# Altium schematic sheet Power.SchDoc
size Tabloid
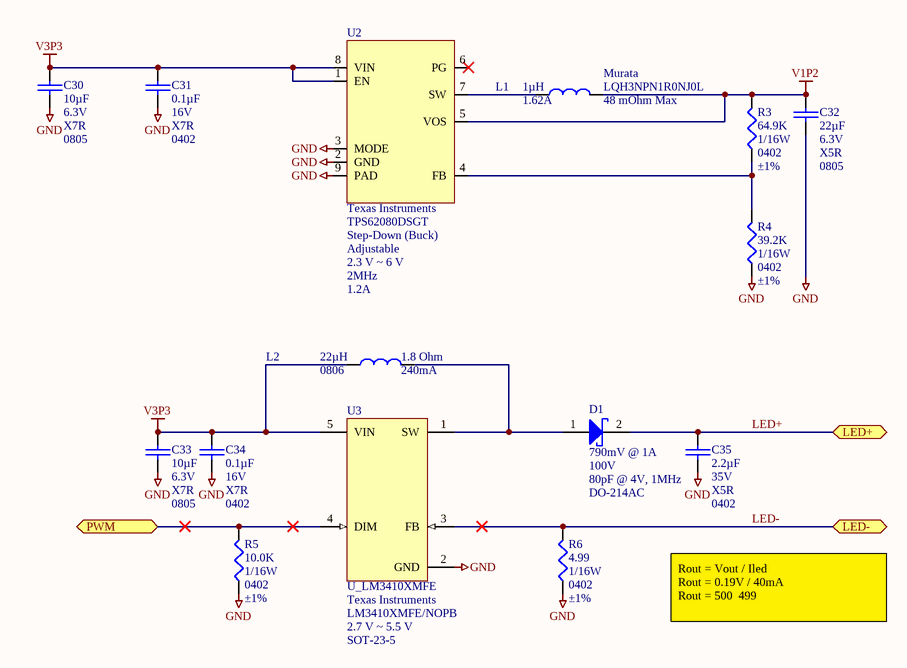
[diagram p0: Power.SchDoc]

## Parts
C30  Capacitance: 10µF  Voltage - Rated: 6.3V  Temperature Coefficient: X7R  Package / Case: 0805  [C_ERA-0805]  (hidden comment: 10uF)
C31  Capacitance: 0.1µF  Voltage - Rated: 16V  Temperature Coefficient: X7R  Package / Case: 0402  [C_ERA-0402]  (hidden comment: 0.1uF)
C32  Capacitance: 22µF  Voltage - Rated: 6.3V  Temperature Coefficient: X5R  Package / Case: 0805  [C_ERA-0805]  (hidden comment: 22uF)
C33  Capacitance: 10µF  Voltage - Rated: 6.3V  Temperature Coefficient: X7R  Package / Case: 0805  [C_ERA-0805]  (hidden comment: 10uF)
C34  Capacitance: 0.1µF  Voltage - Rated: 16V  Temperature Coefficient: X7R  Package / Case: 0402  [C_ERA-0402]  (hidden comment: 0.1uF)
C35  Capacitance: 2.2µF  Voltage - Rated: 35V  Temperature Coefficient: X5R  Package / Case: 0402  [C_ERA-0402]  (hidden comment: C_0402_2.2uF_35V)
D1  Voltage - Forward (Vf) (Max) @ If: 790mV @ 1A  Voltage - DC Reverse (Vr) (Max): 100V  Capacitance @ Vr, F: 80pF @ 4V, 1MHz  Package / Case: DO-214AC  [DIOM5226X23L]  (hidden comment: B1100-13-F)
L1  Manufacturer Part Number: LQH3NPN1R0NJ0L  Inductance: 1µH  Current: 1.62A  DC Resistance (DCR): 48 mOhm Max  Manufacturer: Murata  [INDNRH1212]  (hidden comment: 1.0uH)
L2  Current: 240mA  Package / Case: 0806  Inductance: 22µH  DC Resistance (DCR): 1.8 Ohm  [L_0806]  (hidden comment: CBC2016T220K)
R3  Resistance In Ohms: 64.9K  Power (Watts): 1/16W  Case: 0402  Tolerance: ±1%  [ERA-0402]  (hidden comment: R_0402_64.9K)
R4  Resistance In Ohms: 39.2K  Power (Watts): 1/16W  Case: 0402  Tolerance: ±1%  [ERA-0402]  (hidden comment: R_0402_39.2K)
R5  Resistance In Ohms: 10.0K  Power (Watts): 1/16W  Case: 0402  Tolerance: ±1%  [R_0402]  (hidden comment: R_0402_10.0K)
R6  Resistance In Ohms: 4.99  Power (Watts): 1/16W  Case: 0402  Tolerance: ±1%  [R_0402]  (hidden comment: R_0402_4.99)
U2  Manufacturer: Texas Instruments  Manufacturer Part Number: TPS62080DSGT  Type: Step-Down (Buck)  Output Type: Adjustable  Voltage - Input: 2.3 V ~ 6 V  Frequency - Switching: 2MHz  Current - Output: 1.2A  [QFN50P200X200X80-8L]  (hidden comment: TPS62080)
U3  U_LM3410XMFE  Manufacturer: Texas Instruments  Manufacturer Part Number: LM3410XMFE/NOPB  Voltage - Supply: 2.7 V ~ 5.5 V  Supplier Device Package: SOT-23-5  [MF05A_N]

## Ports
LED+, LED-, PWM

## Nets
GND: C30.1 C31.1 C32.1 C33.1 C34.1 C35.1 R4.2 R5.2 R6.2 U2.2(GND) U2.3(MODE) U2.9(PAD) U3.2(GND)
V1P2: C32.2 L1.2 R3.1 U2.5(VOS)
V3P3: C30.2 C31.2 C33.2 C34.2 L2.1 U2.1(EN) U2.8(VIN) U3.5(VIN)
LED+: C35.2 D1.2(K) ; port LED+
LED-: R6.1 U3.3(FB) ; port LED-
PWM: R5.1 U3.4(DIM) ; port PWM
NetD1_1: D1.1(A) L2.2 U3.1(SW)
NetL1_1: L1.1 U2.7(SW)
NetR3_2: R3.2 R4.1 U2.4(FB)

Not connected (* = marked no-connect by the designer): U2 6(PG)*

## Notes on the sheet
- Rout = Vout / Iled
  Rout = 0.19V / 40mA
  Rout = 500  499
- Title:
- http://www.cospandesign.com
- Cospan Design
- Project:
- Document:
- Engineer:
- Drawn By:
- Approved By:
- Revision:
- Date:
- Number:
- of

## Library data of the parts
C30 C33 = C_0805_10UF_6.3V: CAP CER 10UF 6.3V X7R 10% 0805; Manufacturer: Taiyo Yuden; Manufacturer Part Number: JMK212BJ106KD-T; Supplier 1: Digi-Key; Supplier Part Number 1: 587-1304-1-ND; RoHS: RoHS Compliant; Category: Capacitors; Stock 1: 94004; Tolerance: ±10%; Mounting Type: Surface Mount, MLCC; Operating Temperature: -55°C ~ 85°C; Applications: General Purpose; Ratings: -; Size / Dimension: 0.079" L x 0.049" W (2.00mm x 1.25mm); Lead Spacing: -; Features: -; Packaging: Cut Tape (CT); Lead Style: -; ComponentLink1URL: http://www.yuden.co.jp/productdata/catalog/en/mlcc01_e.pdf; ComponentLink1Description: http://www.yuden.co.jp/productdata/catalog/en/mlcc01_e.pdf; Pricing 1: 1=0.19, 10=0.132, 50=0.08, 100=0.0672, 250=0.0544, 500=0.048, 1000=0.0408 (USD); Height - Seated (Max): -; Thickness (Max): 0.037" (0.95mm)
C31 C34 = C_0402_0.1UF_16V: CAP CER .10UF 16V X7R 0402; Manufacturer: TDK Corporation; Manufacturer Part Number: C1005X7R1C104K; Tolerance: ±10%; Supplier 1: Digi-Key; Supplier Part Number 1: 445-4952-1-ND; RoHS: RoHS Compliant; Category: Capacitors; Stock 1: 230800; Pricing: 10=0.024, 100=0.0143, 500=0.00826, 1000=0.00572 (USD); Mounting Type: Surface Mount, MLCC; Features: General Purpose; Lead Spacing: -; Thickness: 0.50mm; Packaging: Cut Tape (CT); ComponentLink1URL: http://www.tdk.co.jp/tefe02/e412_c.pdf; ComponentLink1Description: http://www.tdk.co.jp/tefe02/e412_c.pdf; Operating Temperature: -55°C ~ 125°C
C32 = C_0805_22UF_6.3V: CAP CER 22UF 6.3V X7R 10% 0805; Manufacturer: AVX Corporation; Manufacturer Part Number: 08056D226MAT2A; Tolerance: ±20%; Supplier 1: Digi-Key; Supplier Part Number 1: 478-3647-1-ND; RoHS: RoHS Compliant; Category: Capacitors; Stock 1: 183735; Pricing: 10=0.66, 100=0.39, 500=0.225, 1000=0.156 (USD); Mounting Type: Surface Mount, MLCC; Operating Temperature: -55°C ~ 85°C; Applications: General Purpose; Ratings: -; Size / Dimension: 0.079" L x 0.049" W (2.01mm x 1.25mm); Height: -; Thickness: 0.055" (1.40mm); Lead Spacing: -; Features: -; Packaging: Cut Tape (CT); Lead Style: -; ComponentLink1URL: http://www.avx.com/docs/Catalogs/cx5r.pdf; ComponentLink1Description: http://www.avx.com/docs/Catalogs/cx5r.pdf; Supplier 2: Digi-Key; Supplier Part Number 2: 587-1305-1-ND; Stock 2: 167108; Height - Seated (Max): -; Thickness (Max): 0.053" (1.35mm); ComponentLink2URL: http://www.yuden.co.jp/productdata/catalog/en/mlcc01_e.pdf; ComponentLink2Description: http://www.yuden.co.jp/productdata/catalog/en/mlcc01_e.pdf
C35 = C_0402_2.2uF_35V: CAP CER 2.2UF 35V 20% X5R 0402; Manufacturer: TDK Corporation; Manufacturer Part Number: C1005X5R1V225M050BC; Supplier 1: Digi-Key; Supplier Part Number 1: 445-9056-1-ND; RoHS: RoHS Compliant; Category: Capacitors; Stock 1: 23001; Pricing: 1=0.37, 10=0.308, 100=0.154, 250=0.11552, 500=0.10202, 1000=0.09048, 5000=0.07508 (USD); Packaging: Cut Tape (CT); Tolerance: ±20%; Mounting Type: Surface Mount, MLCC; Operating Temperature: -55°C ~ 85°C; Applications: General Purpose; Ratings: -; Size / Dimension: 0.039" L x 0.020" W (1.00mm x 0.50mm); Height - Seated (Max): -; Thickness (Max): 0.022" (0.55mm); Lead Spacing: -; Features: -; Lead Style: -; ComponentLink1URL: http://product.tdk.com/en/catalog/datasheets/mlcc_commercial_general_en.pdf; ComponentLink1Description: http://product.tdk.com/en/catalog/datasheets/mlcc_commercial_general_en.pdf
D1 = D_SCHOTT_B1100-13-F: DIODE SCHOTTKY 100V 1A SMA; Manufacturer: Diodes Inc; Speed: Fast Recovery =< 500ns, > 200mA (Io); Current - Reverse Leakage @ Vr: 500µA @ 100V; Supplier 1: Digi-Key; Supplier Part Number 1: B1100-FDICT-ND; Manufacturer Part Number: B1100-13-F; RoHS: RoHS Compliant; Category: Discrete Semiconductor Products; Stock 1: 109264; Pricing: 1=0.57, 10=0.4, 25=0.3288, 100=0.2627, 250=0.1914, 500=0.15544, 1000=0.11948, 2500=0.1073 (USD); Diode Type: Schottky; Current - Average Rectified (Io): 1A; Reverse Recovery Time (trr): -; Mounting Type: Surface Mount; Supplier Device Package: SMA; Packaging: Cut Tape (CT); ComponentLink1URL: http://www.diodes.com/datasheets/ds30018.pdf; ComponentLink1Description: http://www.diodes.com/datasheets/ds30018.pdf; COST_1: *; COST_100: *; COST_1000: *; MANF1: *; MANF1_PN: *; MANF2: *; MANF2_PN: *; MANF3: *; MANF3_PN: *; VENDOR1: *; VENDOR1_PN: *
L1 = L_1.0UH_1.62A: INDUCTOR POWER 1.0UH 1620MA 1212; Current - Saturation: 1.65A; Type: Ferrite Core; Tolerance: ±30%; Shielding: Shielded; Frequency - Self Resonant: 140MHz; Material - Core: Ferrite; Frequency - Test: 1MHz; Supplier 1: Digi-Key; Supplier Part Number 1: 490-5342-1-ND; RoHS: RoHS Compliant; Category: Inductors, Coils, Chokes; Stock 1: 2940; Pricing: 1=0.43, 10=0.387, 25=0.3436, 50=0.3006, 100=0.2792, 250=0.25772, 500=0.24482 (USD); Current - Temperature Rise: 1.62A; Q @ Freq: -; Applications: Power Supplies; Package / Case: 1212 (3030 Metric); Mounting Type: Surface Mount; Packaging: Cut Tape (CT); Operating Temperature: -40°C ~ 85°C; ComponentLink1URL: http://search.murata.co.jp/Ceramy/image/img/PDF/ENG/L0075S0103LQH3NP_J0.pdf; ComponentLink1Description: http://search.murata.co.jp/Ceramy/image/img/PDF/ENG/L0075S0103LQH3NP_J0.pdf
L2 = L_0806_22uH: INDUCTOR 22UH 10% 0806 SMD; Manufacturer: Taiyo Yuden; Type: Wirewound; Current - Saturation: 250mA; Shielding: Unshielded; Frequency - Self Resonant: 16MHz; Frequency - Test: 2.52MHz; Supplier 1: Digi-Key; Supplier Part Number 1: 587-3048-1-ND; Manufacturer Part Number: CBC2016T220K; RoHS: RoHS Compliant; Category: Inductors, Coils, Chokes; Stock 1: 3275; Pricing: 1=0.2, 10=0.192, 50=0.18, 100=0.168, 500=0.132, 1000=0.108 (USD); Packaging: Cut Tape (CT); Material - Core: -; Tolerance: ±10%; Current Rating: 240mA; Q @ Freq: -; Operating Temperature: -40°C ~ 105°C; Mounting Type: Surface Mount; Size / Dimension: 0.079" L x 0.063"W (2.00mm x 1.60mm); Height - Seated (Max): 0.071" (1.80mm); Supplier Device Package: 0806 (2016 Metric); ComponentLink1URL: http://www.yuden.co.jp/ut/product/category/inductor/CBC2016T220K.pdf; ComponentLink1Description: http://www.yuden.co.jp/ut/product/category/inductor/CBC2016T220K.pdf
R3 = R_0402_64.9K: RES 64.9K OHM 1/16W 1% 0402 SMD; Manufacturer: Yageo; Manufacturer Part Number: RC0402FR-0764K9L; Temperature Coefficient: ±100ppm/°C; Supplier 1: Digi-Key; Supplier Part Number 1: 311-64.9KLRCT-ND; RoHS: RoHS Compliant; Category: Resistors; Stock 1: 52870; Pricing: 10=0.014, 50=0.0104, 100=0.0079, 250=0.00584, 500=0.00432, 1000=0.00288 (USD); Resistance (Ohms): 64.9K; Composition: Thick Film; Features: -; Size / Dimension: 0.039" L x 0.020" W (1.00mm x 0.50mm); Height: 0.016" (0.40mm); Number of Terminations: 2; Packaging: Cut Tape (CT); Package / Case: 0402 (1005 Metric); ComponentLink1URL: http://www.yageo.com/documents/recent/PYu-RC0402_51_RoHS_L_6.pdf; ComponentLink1Description: http://www.yageo.com/documents/recent/PYu-RC0402_51_RoHS_L_6.pdf
R4 = R_0402_39.2K: RES 39.2K OHM 1/16W 1% 0402 SMD; Manufacturer: Yageo; Manufacturer Part Number: RC0402FR-0739K2L; Temperature Coefficient: ±100ppm/°C; Supplier 1: Digi-Key; RoHS: RoHS Compliant; Category: Resistors; Stock 1: 76395; Pricing 1: 10=0.014, 100=0.0063, 500=0.00382, 1000=0.0027, 5000=0.00203 (USD); Resistance (Ohms): 39.2K; Composition: Thick Film; Features: -; Package / Case: 0402 (1005 Metric); Size / Dimension: 0.039" L x 0.020" W (1.00mm x 0.50mm); Height: 0.016" (0.40mm); Number of Terminations: 2; Packaging: Cut Tape (CT); ComponentLink1URL: http://www.yageo.com/documents/recent/PYu-RC0402_51_RoHS_L_6.pdf; ComponentLink1Description: http://www.yageo.com/documents/recent/PYu-RC0402_51_RoHS_L_6.pdf; Supplier Part Number 1: 311-39.2KLRCT-ND
R5 = R_0402_10.0K: RES 10.0K OHM 1/16W 1% 0402 SMD; Manufacturer: Stackpole Electronics Inc; Manufacturer Part Number: RMCF0402FT10K0; Resistance (Ohms): 10k; Temperature Coefficient: ±100ppm/°C; Supplier 1: Digi-Key; Supplier Part Number 1: RMCF0402FT10K0CT-ND; RoHS: RoHS Compliant; Category: Resistors; Stock 1: 234525; Pricing: 1=0.04, 10=0.025, 50=0.0138, 100=0.0105, 250=0.0078, 500=0.00576, 1000=0.00384, 2500=0.00324, 5000=0.0027 (USD); Composition: Thick Film; Features: -; Package / Case: 0402 (1005 Metric); Size / Dimension: 0.039" L x 0.020" W (1.00mm x 0.50mm); Height: 0.016" (0.40mm); Number of Terminations: 2; Packaging: Cut Tape (CT); ComponentLink1URL: http://www.seielect.com/Catalog/SEI-RMCF_RMCP.pdf; ComponentLink1Description: http://www.seielect.com/Catalog/SEI-RMCF_RMCP.pdf; COST_1: *; COST_100: *; COST_1000: *; MANF1: *; MANF1_PN: *; MANF2: *; MANF2_PN: *; MANF3: *; MANF3_PN: *; VENDOR1: *; VENDOR1_PN: *
R6 = R_0402_4.99: RES 4.99 OHM 1/16W 1% 0402; Manufacturer: Stackpole Electronics Inc; Manufacturer Part Number: RMCF0402FT4R99; Temperature Coefficient: ±200ppm/°C; Supplier 1: Digi-Key; RoHS: RoHS Compliant; Category: Resistors; Stock 1: 25268; Pricing 1: 1=0.1, 10=0.025, 50=0.0138, 100=0.0105, 250=0.0078, 500=0.00576, 1000=0.00384, 2500=0.00324, 5000=0.0027 (USD); Packaging: Cut Tape (CT); Resistance (Ohms): 4.99; Composition: Thick Film; Features: -; Operating Temperature: -55°C ~ 155°C; Package / Case: 0402 (1005 Metric); Supplier Device Package: 0402; Size / Dimension: 0.039" L x 0.020" W (1.00mm x 0.50mm); Height: 0.016" (0.40mm); Number of Terminations: 2; ComponentLink1URL: http://www.seielect.com/Catalog/SEI-RMCF_RMCP.pdf; ComponentLink1Description: http://www.seielect.com/Catalog/SEI-RMCF_RMCP.pdf; Supplier Part Number 1: RMCF0402FT4R99CT-ND
U2 = U_TPS62080: IC BUCK SYNC ADJ 1.2A 8WSON; Number of Outputs: 1; Voltage - Output: 0.5 V ~ 4 V; PWM Type: Hybrid; Synchronous Rectifier: Yes; Supplier 1: Digi-Key; Supplier Part Number 1: 296-29645-1-ND; RoHS: RoHS Compliant; Category: Integrated Circuits (ICs); Stock 1: 288; Pricing: 1=4.03, 10=3.612, 25=3.248, 100=2.954 (USD); Operating Temperature: -40°C ~ 85°C; Mounting Type: Surface Mount; Package / Case: 8-WFDFN Exposed Pad; Packaging: Cut Tape (CT); Supplier Device Package: 8-WSON Exposed Pad (2x2); ComponentLink1URL: http://www.ti.com/lit/ds/symlink/tps62080.pdf; ComponentLink1Description: http://www.ti.com/lit/ds/symlink/tps62080.pdf
U3 = U_LM3410XMFE: IC DRVR WT/OLED BCKLT SOT23-5; Constant Current: Yes; Topology: PWM, SEPIC, Step-Up (Boost); Number of Outputs: 1; Type - Primary: Automotive, Backlight, Flash/Torch; Type - Secondary: High Brightness LED (HBLED), OLED, White LED; Frequency: 1.2MHz ~ 2MHz; Voltage - Output: 3 V ~ 24 V; Supplier 1: Digi-Key; Supplier Part Number 1: LM3410XMFE/NOPBCT-ND; RoHS: RoHS Compliant; Category: Integrated Circuits (ICs); Stock 1: 405; Pricing: 1=2.98, 10=2.67, 25=2.4012, 100=2.1839 (USD); Packaging: Cut Tape (CT); Constant Voltage: -; Internal Driver: Yes; Mounting Type: Surface Mount; Package / Case: SC-74A, SOT-753; Operating Temperature: -40°C ~ 125°C; ComponentLink1URL: http://www.ti.com/lit/ds/symlink/lm3410.pdf; ComponentLink1Description: http://www.ti.com/lit/ds/symlink/lm3410.pdf